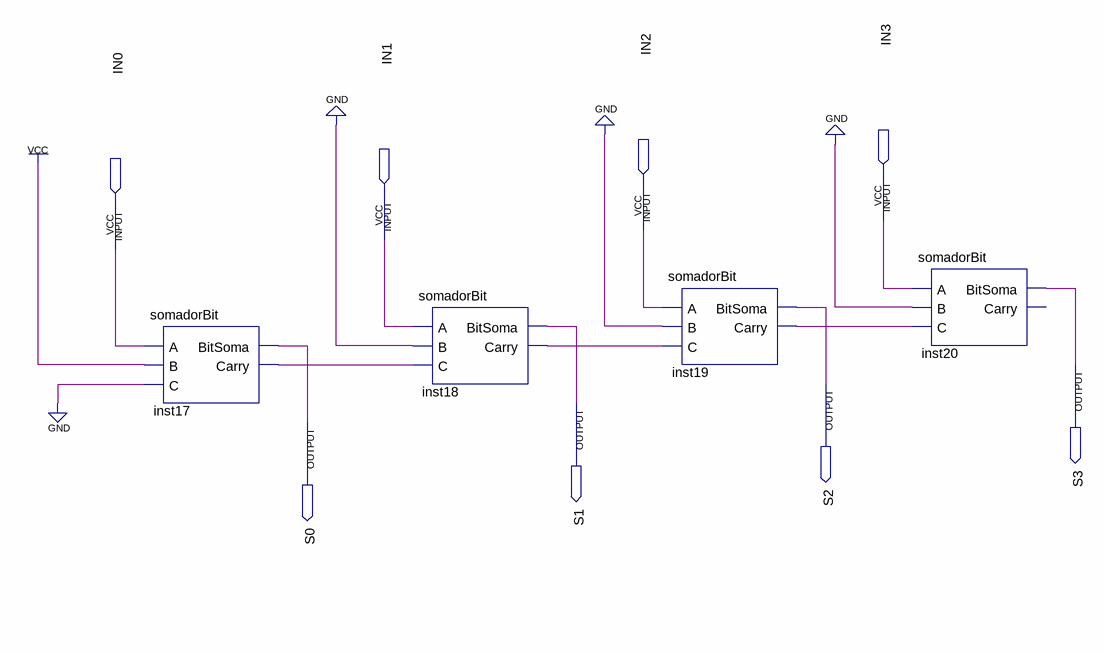
[diagram p0: schematic sheet]
// Quartus schematic soma1.bdf as structural Verilog: 4 symbols, 8 pins
module soma1 (
  input  IN3,
  input  IN2,
  input  IN1,
  input  IN0,
  output S3,
  output S2,
  output S1,
  output S0
);

  wire inst17_carry, inst18_carry, inst19_carry;

  somadorBit inst17 (.A(IN0), .B(1'b1), .C(1'b0), .BitSoma(S0), .Carry(inst17_carry));
  somadorBit inst18 (.A(IN1), .B(1'b0), .C(inst17_carry), .BitSoma(S1), .Carry(inst18_carry));
  somadorBit inst19 (.A(IN2), .B(1'b0), .C(inst18_carry), .BitSoma(S2), .Carry(inst19_carry));
  somadorBit inst20 (.A(IN3), .B(1'b0), .C(inst19_carry), .BitSoma(S3));  // open: Carry
endmodule
